# EAGLE schematic M840K (EAGLE 6.6.0)

## Sheet 1 of 2
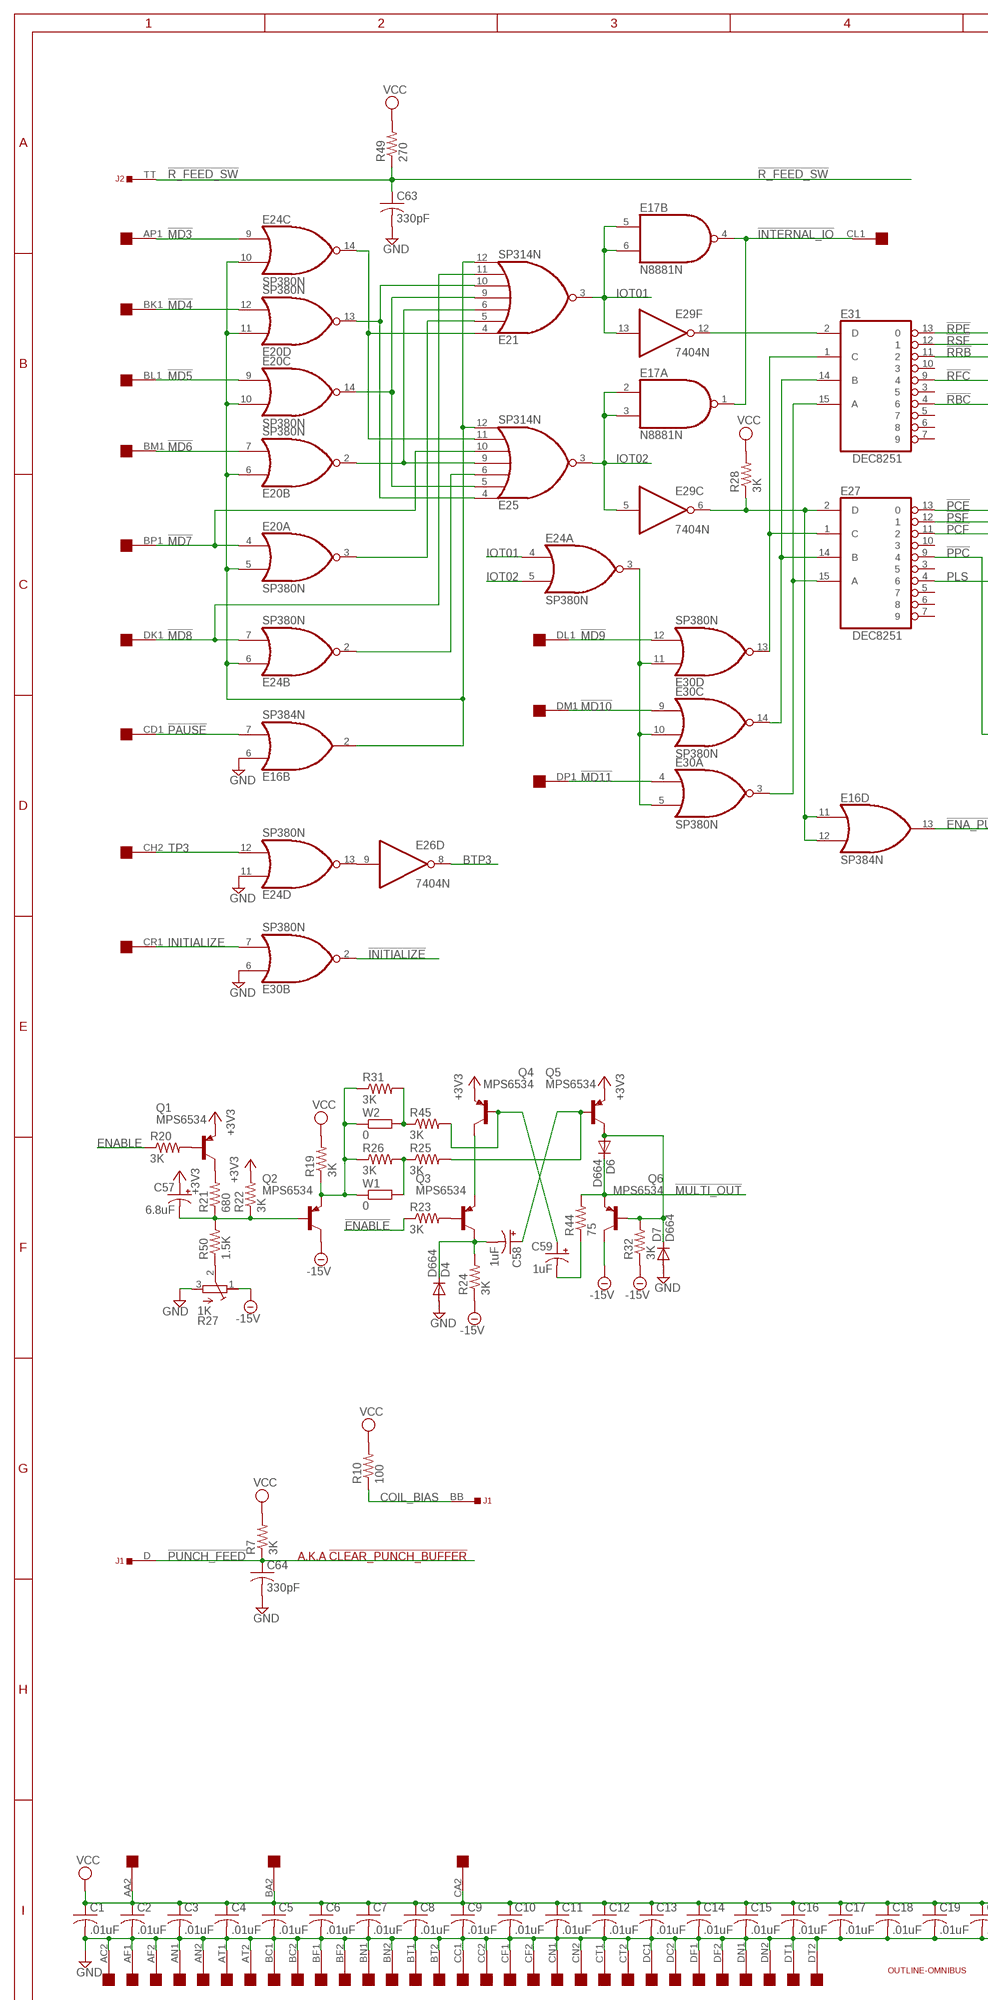
[diagram p0: schematic, sheet 1, part 1 of 2]
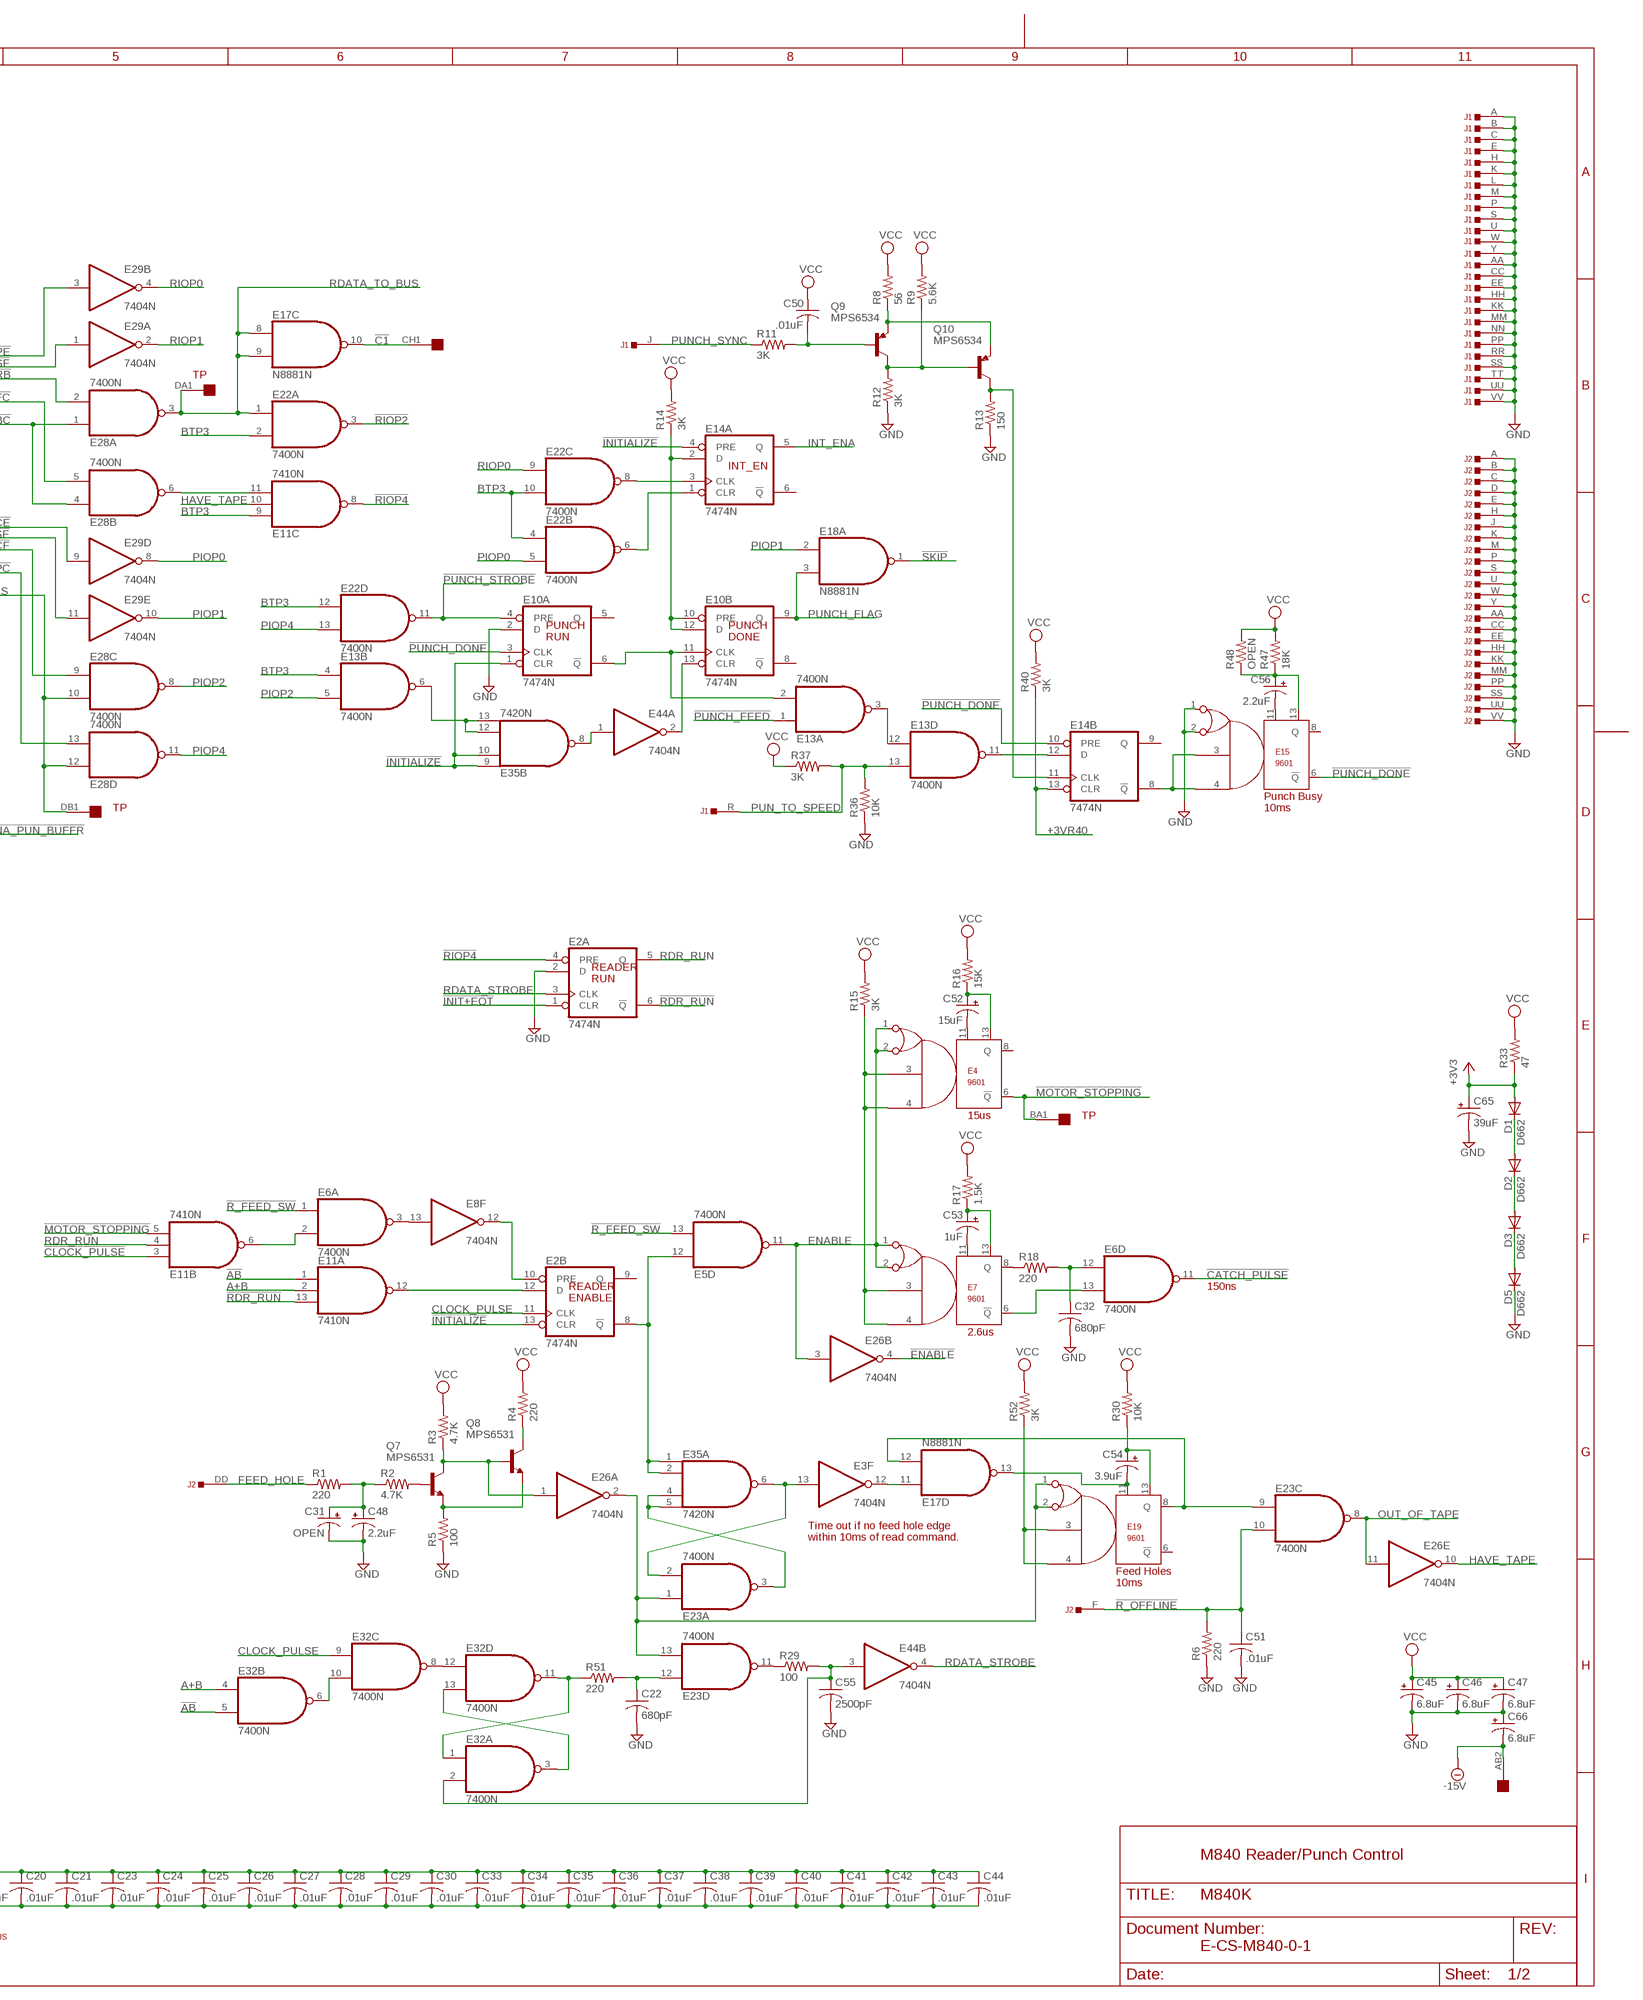
[diagram p1: schematic, sheet 1, part 2 of 2]

### Parts
C1  .01uF  C-US  [C063-025X075]
C2  .01uF  C-US  [C063-025X075]
C3  .01uF  C-US  [C063-025X075]
C4  .01uF  C-US  [C063-025X075]
C5  .01uF  C-US  [C063-025X075]
C6  .01uF  C-US  [C063-025X075]
C7  .01uF  C-US  [C063-025X075]
C8  .01uF  C-US  [C063-025X075]
C9  .01uF  C-US  [C063-025X075]
C10  .01uF  C-US  [C063-025X075]
C11  .01uF  C-US  [C063-025X075]
C12  .01uF  C-US  [C063-025X075]
C13  .01uF  C-US  [C063-025X075]
C14  .01uF  C-US  [C063-025X075]
C15  .01uF  C-US  [C063-025X075]
C16  .01uF  C-US  [C063-025X075]
C17  .01uF  C-US  [C063-025X075]
C18  .01uF  C-US  [C063-025X075]
C19  .01uF  C-US  [C063-025X075]
C20  .01uF  C-US  [C063-025X075]
C21  .01uF  C-US  [C063-025X075]
C22  680pF  C-US  [C063-025X075]
C23  .01uF  C-US  [C063-025X075]
C24  .01uF  C-US  [C063-025X075]
C25  .01uF  C-US  [C063-025X075]
C26  .01uF  C-US  [C063-025X075]
C27  .01uF  C-US  [C063-025X075]
C28  .01uF  C-US  [C063-025X075]
C29  .01uF  C-US  [C063-025X075]
C30  .01uF  C-US  [C063-025X075]
C31  OPEN  CPOL-USE15-5AXIAL  [E15-5]
C32  680pF  C-US  [C063-025X075]
C33  .01uF  C-US  [C063-025X075]
C34  .01uF  C-US  [C063-025X075]
C35  .01uF  C-US  [C063-025X075]
C36  .01uF  C-US  [C063-025X075]
C37  .01uF  C-US  [C063-025X075]
C38  .01uF  C-US  [C063-025X075]
C39  .01uF  C-US  [C063-025X075]
C40  .01uF  C-US  [C063-025X075]
C41  .01uF  C-US  [C063-025X075]
C42  .01uF  C-US  [C063-025X075]
C43  .01uF  C-US  [C063-025X075]
C44  .01uF  C-US  [C063-025X075]
C45  6.8uF  CPOL-USE20-8AXIAL  [E12-8]
C46  6.8uF  CPOL-USE20-8AXIAL  [E12-8]
C47  6.8uF  CPOL-USE20-8AXIAL  [E12-8]
C48  2.2uF  CPOL-USE15-5AXIAL  [E15-5]
C50  .01uF  C-US8  [C203-054-229]
C51  .01uF  C-US8  [C203-054-229]
C52  15uF  CPOL-USE20-8AXIAL  [E12-8]
C53  1uF  CPOL-USE15-5AXIAL  [E15-5]
C54  3.9uF  CPOL-USE15-5AXIAL  [E15-5]
C55  2500pF  C-US  [C063-025X075]
C56  2.2uF  CPOL-USE15-5AXIAL  [E15-5]
C57  6.8uF  CPOL-USE20-8AXIAL  [E12-8]
C58  1uF  CPOL-USE15-5AXIAL  [E15-5]
C59  1uF  CPOL-USE15-5AXIAL  [E15-5]
C63  330pF  C-US  [C063-025X075]
C64  330pF  C-US  [C063-025X075]
C65  39uF  CPOL-USE20-8AXIAL  [E12-8]
C66  6.8uF  CPOL-USE20-8AXIAL  [E12-8]
D1  D662  DIODE-DO35-10  [DO35-10]
D2  D662  DIODE-DO35-10  [DO35-10]
D3  D662  DIODE-DO35-10  [DO35-10]
D4  D664  DIODE-DO35-10  [DO35-10]
D5  D662  DIODE-DO35-10  [DO35-10]
D6  D664  DIODE-DO35-10  [DO35-10]
D7  D664  DIODE-DO35-10  [DO35-10]
E2  7474N  74S74N  [DIL14]
E3  7404N  [DIL14]
E4  9601  [DIL14]
E5  7400N  [DIL14]
E6  7400N  [DIL14]
E7  9601  [DIL14]
E8  7404N  [DIL14]
E10  7474N  74S74N  [DIL14]
E11  7410N  [DIL14]
E13  7400N  [DIL14]
E14  7474N  74S74N  [DIL14]
E15  9601  [DIL14]
E16  SP384N  [DIL14]
E17  N8881N  [DIL14]
E18  N8881N  [DIL14]
E19  9601  [DIL14]
E20  SP380N  [DIL14]
E21  SP314N  [DIL14]
E22  7400N  [DIL14]
E23  7400N  [DIL14]
E24  SP380N  [DIL14]
E25  SP314N  [DIL14]
E26  7404N  [DIL14]
E27  DEC8251  [DIL16]
E28  7400N  [DIL14]
E29  7404N  [DIL14]
E30  SP380N  [DIL14]
E31  DEC8251  [DIL16]
E32  7400N  [DIL14]
E35  7420N  [DIL14]
E44  7404N  [DIL14]
J1  DEC40PINSH  [DEC40PINH]
J2  DEC40PINSH  [DEC40PINH]
OMNIBUS  QUAD  [EDGE-CON8]
Q1  MPS6534  -PNP-TO5  [TO5]
Q2  MPS6534  -PNP-TO5  [TO5]
Q3  MPS6534  -PNP-TO5  [TO5]
Q4  MPS6534  -PNP-TO5  [TO5]
Q5  MPS6534  -PNP-TO5  [TO5]
Q6  MPS6534  -PNP-TO5  [TO5]
Q7  MPS6531  -NPN-TO5  [TO5]
Q8  MPS6531  -NPN-TO5  [TO5]
Q9  MPS6534  -PNP-TO5  [TO5]
Q10  MPS6534  -PNP-TO5  [TO5]
R1  220  R-US_0207/10  [0207/10]
R2  4.7K  R-US_0207/10  [0207/10]
R3  4.7K  R-US_0207/10  [0207/10]
R4  220  R-US_0207/10  [0207/10]
R5  100  R-US_0207/10  [0207/10]
R6  220  R-US_0207/10  [0207/10]
R7  3K  R-US_0207/10  [0207/10]
R8  56  R-US_0207/10  [0207/10]
R9  5.6K  R-US_0207/10  [0207/10]
R10  100  R-US_0207/10  [0207/10]
R11  3K  R-US_0207/10  [0207/10]
R12  3K  R-US_0207/10  [0207/10]
R13  150  R-US_0207/10  [0207/10]
R14  3K  R-US_0207/10  [0207/10]
R15  3K  R-US_0207/10  [0207/10]
R16  15K  R-US_0207/10  [0207/10]
R17  1.5K  R-US_0207/10  [0207/10]
R18  220  R-US_0207/10  [0207/10]
R19  3K  R-US_0207/10  [0207/10]
R20  3K  R-US_0207/10  [0207/10]
R21  680  R-US_0207/10  [0207/10]
R22  3K  R-US_0207/10  [0207/10]
R23  3K  R-US_0207/10  [0207/10]
R24  3K  R-US_0207/10  [0207/10]
R25  3K  R-US_0207/10  [0207/10]
R26  3K  R-US_0207/10  [0207/10]
R27  1K  275P  [3006Y]
R28  3K  R-US_0207/10  [0207/10]
R29  100  R-US_0207/10  [0207/10]
R30  10K  R-US_0207/10  [0207/10]
R31  3K  R-US_0207/10  [0207/10]
R32  3K  R-US_0207/10  [0207/10]
R33  47  R-US_0207/10  [0207/10]
R36  10K  R-US_0207/10  [0207/10]
R37  3K  R-US_0207/10  [0207/10]
R40  3K  R-US_0207/10  [0207/10]
R44  75  R-US_0207/10  [0207/10]
R45  3K  R-US_0207/10  [0207/10]
R47  18K  R-US_0207/10  [0207/10]
R48  OPEN  R-US_0207/10  [0207/10]
R49  270  R-US_0207/10  [0207/10]
R50  1.5K  R-US_0207/10  [0207/10]
R51  220  R-US_0207/10  [0207/10]
R52  3K  R-US_0207/10  [0207/10]
U$1  OUTLINE-OMNIBUS  [OMNIBUS]
W1  0  R-EU_0207/10  [0207/10]
W2  0  R-EU_0207/10  [0207/10]

### Nets
!AB: E11.1(A:I0) E32.5(B:I1) ; also sheet 2
!C1: E17.10(C:O) OMNIBUS.CH1
!CATCH_PULSE: E6.11(D:O) ; also sheet 2
!CLOCK_PULSE: E11.3(B:I0) ; also sheet 2
!ENA_PUN_BUFFR: E16.13(D:O) ; also sheet 2
!ENABLE: E26.4(B:O) R23.1
!INIT+EOT: E2.1(A:CLR) ; also sheet 2
!INITIALIZE: E2.13(B:CLR) E10.1(A:CLR) E14.4(A:PRE) E30.2(B:O) E35.9(B:I0) E35.10(B:I1) ; also sheet 2
!INTERNAL_IO: E17.1(A:O) E17.4(B:O) OMNIBUS.CL1
!IOT: E24.3(A:O) E30.5(A:I1) E30.10(C:I1) E30.11(D:I0)
!MD3: E24.9(C:I0) OMNIBUS.AP1
!MD4: E20.12(D:I1) OMNIBUS.BK1
!MD5: E20.9(C:I0) OMNIBUS.BL1
!MD6: E20.7(B:I1) OMNIBUS.BM1
!MD7: E20.4(A:I0) E25.10(I4) OMNIBUS.BP1
!MD8: E21.11(I5) E24.7(B:I1) OMNIBUS.DK1
!MD9: E30.12(D:I1) OMNIBUS.DL1
!MD10: E30.9(C:I0) OMNIBUS.DM1
!MD11: E30.4(A:I0) OMNIBUS.DP1
!MOTOR_STOPPING: E4.6(!Q) E11.5(B:I2) OMNIBUS.BA1 ; also sheet 2
!MULTI_OUT: D6.C Q6.1(E) R44.2 ; also sheet 2
!PAUSE: E16.7(B:I1) OMNIBUS.CD1
!PCE: E27.13 E29.9(D:I)
!PCF: E27.11 E28.9(C:I0)
!PPC: E27.9 E28.13(D:I1)
!PSF: E27.12 E29.11(E:I)
!PUNCH_DONE: E10.3(A:CLK) E14.10(B:PRE) E15.6(!Q) ; also sheet 2
!PUNCH_FEED: C64.1 E13.1(A:I0) J1.D R7.1 ; also sheet 2
!PUNCH_STROBE: E10.4(A:PRE) E22.11(D:O) ; also sheet 2
!R_FEED_SW: C63.1 E5.13(D:I1) E6.1(A:I0) J2.TT R49.1
!R_OFFLINE: C51.1 E23.10(C:I1) J2.F R6.2
!RBC: E28.1(A:I0) E28.4(B:I0) E31.4
!RDR_RUN: E2.6(A:!Q) E11.13(A:I2)
!RFC: E28.5(B:I1) E31.9
!RIOP2: E22.3(A:O) ; also sheet 2
!RIOP4: E2.4(A:PRE) E11.8(C:O) ; also sheet 2
!RPE: E29.3(B:I) E31.13
!RRB: E28.2(A:I1) E31.11
!RSF: E29.1(A:I) E31.12
!SKIP: E18.1(A:O) ; also sheet 2
+3V3: C57.+ C65.+ D1.A Q1.1(E) Q4.1(E) Q5.1(E) R22.2 R33.1
+3VR40: E14.13(B:CLR) R40.1 ; also sheet 2
-15V [supply]: C66.- OMNIBUS.AB2 Q2.3(C) Q6.3(C) R24.1 R27.1(A) R32.1
A+B: E11.2(A:I1) E32.4(B:I0) ; also sheet 2
BTP3: E11.9(C:I0) E13.4(B:I0) E22.2(A:I1) E22.4(B:I0) E22.10(C:I1) E22.12(D:I0) E26.8(D:O)
CLOCK_PULSE: E2.11(B:CLK) E32.9(C:I0) ; also sheet 2
COIL_BIAS: J1.BB R10.1
ENABLE: E4.1 E4.2 E5.11(D:O) E7.1 E7.2 E26.3(B:I) R20.1 ; also sheet 2
FEED_HOLE: J2.DD R1.1
GND [supply]: C1.2 C2.2 C3.2 C4.2 C5.2 C6.2 C7.2 C8.2 C9.2 C10.2 C11.2 C12.2 C13.2 C14.2 C15.2 C16.2 C17.2 C18.2 C19.2 C20.2 C21.2 C22.2 C23.2 C24.2 C25.2 C26.2 C27.2 C28.2 C29.2 C30.2 C31.- C32.2 C33.2 C34.2 C35.2 C36.2 C37.2 C38.2 C39.2 C40.2 C41.2 C42.2 C43.2 C44.2 C45.- C46.- C47.- C48.- C51.2 C55.2 C63.2 C64.2 C65.- C66.+ D4.A D5.C D7.A E2.2(A:D) E10.2(A:D) E15.1 E15.2 E16.6(B:I0) E24.11(D:I0) E30.6(B:I0) J1.A J1.AA J1.B J1.C J1.CC J1.E J1.EE J1.H J1.HH J1.K J1.KK J1.L J1.M J1.MM J1.NN J1.P J1.PP J1.RR J1.S J1.SS J1.TT J1.U J1.UU J1.VV J1.W J1.Y J2.A J2.AA J2.B J2.C J2.CC J2.D J2.E J2.EE J2.H J2.HH J2.J J2.K J2.KK J2.M J2.MM J2.P J2.PP J2.S J2.SS J2.U J2.UU J2.VV J2.W J2.Y OMNIBUS.AC2 OMNIBUS.AF1 OMNIBUS.AF2 OMNIBUS.AN1 OMNIBUS.AN2 OMNIBUS.AT1 OMNIBUS.AT2 OMNIBUS.BC1 OMNIBUS.BC2 OMNIBUS.BF1 OMNIBUS.BF2 OMNIBUS.BN1 OMNIBUS.BN2 OMNIBUS.BT1 OMNIBUS.BT2 OMNIBUS.CC1 OMNIBUS.CC2 OMNIBUS.CF1 OMNIBUS.CF2 OMNIBUS.CN1 OMNIBUS.CN2 OMNIBUS.CT1 OMNIBUS.CT2 OMNIBUS.DC1 OMNIBUS.DC2 OMNIBUS.DF1 OMNIBUS.DF2 OMNIBUS.DN1 OMNIBUS.DN2 OMNIBUS.DT1 OMNIBUS.DT2 R5.1 R6.1 R12.1 R13.1 R27.3(E) R36.1 ; also sheet 2
HAVE_TAPE: E11.10(C:I1) E26.10(E:O)
INITIALIZE: E30.7(B:I1) OMNIBUS.CR1
INT_ENA: E14.5(A:Q) ; also sheet 2
IOT01: E17.5(B:I0) E17.6(B:I1) E21.3(O) E24.4(A:I0) E29.13(F:I)
IOT02: E17.2(A:I0) E17.3(A:I1) E24.5(A:I1) E25.3(O) E29.5(C:I)
N$1: E24.13(D:O) E26.9(D:I)
N$2: C31.+ C48.+ R1.2 R2.1
N$3: Q7.1(E) Q8.1(E) R5.2
N$4: E27.1(C) E30.13(D:O) E31.1(C)
N$5: E20.2(B:O) E21.6(I2) E25.9(I3)
N$6: E16.2(B:O) E20.5(A:I1) E20.6(B:I0) E20.10(C:I1) E20.11(D:I0) E21.12(I6) E24.6(B:I0) E24.10(C:I1) E25.12(I6)
N$7: E26.1(A:I) Q7.3(C) Q8.2(B) R3.1
N$8: Q7.2(B) R2.2
N$9: Q8.3(C) R4.1
N$10: E21.4(I0) E24.14(C:O) E25.11(I5)
N$11: Q9.1(E) Q10.1(E) R8.1
N$12: E20.13(D:O) E21.10(I4) E25.4(I0)
N$13: C50.2 Q9.2(B) R11.2
N$14: E20.14(C:O) E21.9(I3) E25.5(I1)
N$15: E24.2(B:O) E25.6(I2)
N$16: E29.12(F:O) E31.2(D)
N$17: E20.3(A:O) E21.5(I1)
N$18: E16.11(D:I0) E16.12(D:I1) E27.2(D) E29.6(C:O) R28.1
N$19: E27.14(B) E30.14(C:O) E31.14(B)
N$20: E27.15(A) E30.3(A:O) E31.15(A)
N$21: Q9.3(C) Q10.2(B) R9.1 R12.2
N$22: E14.11(B:CLK) Q10.3(C) R13.2
N$25: E11.11(C:I2) E28.6(B:O)
N$38: D3.C D5.A
N$44: D2.C D3.A
N$45: R25.1 R26.2 W1.2
N$68: D1.C D2.A
N$77: Q3.2(B) R23.2
N$79: E14.3(A:CLK) E22.8(C:O)
N$80: E14.1(A:CLR) E22.6(B:O)
N$81: E10.10(B:PRE) E10.12(B:D) E14.2(A:D) R14.1
N$82: E4.3 E4.4 E7.3 E7.4 R15.1
N$83: C52.- E4.11
N$84: C52.+ E4.13 R16.1
N$85: C53.- E7.11
N$86: C53.+ E7.13 R17.1
N$87: E7.8(Q) R18.1
N$88: C32.1 E6.12(D:I0) R18.2
N$89: E6.13(D:I1) E7.6(!Q)
N$90: E2.8(B:!Q) E5.12(D:I0) E35.1(A:I0) E35.2(A:I1)
N$91: D6.A D7.C Q5.3(C) Q6.2(B) R32.2
N$92: Q1.2(B) R20.2
N$93: C54.- E17.13(D:O) E19.11
N$94: Q1.3(C) R21.2
N$95: C57.- Q2.2(B) R21.1 R22.1 R50.2
N$96: R27.2(S) R50.1
N$97: Q2.1(E) R19.1 R26.1 R31.1 W1.1 W2.1
N$98: R31.2 R45.1 W2.2
N$99: Q3.1(E) Q4.3(C)
N$100: C54.+ E19.13 R30.1
N$101: E19.3 E19.4 R52.1
N$102: C58.+ Q5.2(B) R25.2
N$103: C59.+ Q4.2(B) R45.2
N$104: C58.- D4.C Q3.3(C) R24.2
N$105: C59.- R44.1
N$106: E19.1 E19.2 E23.1(A:I0) E23.13(D:I1) E26.2(A:O)
N$107: E17.12(D:I1) E19.8(Q) E23.9(C:I0)
N$108: C22.1 E23.12(D:I0) R51.2
N$109: E3.12(F:O) E17.11(D:I0)
N$110: E3.13(F:I) E23.2(A:I1) E35.6(A:O)
N$111: E23.3(A:O) E35.4(A:I2) E35.5(A:I3)
N$112: E32.1(A:I0) E32.11(D:O) R51.1
N$113: E2.10(B:PRE) E8.12(F:O)
N$114: E32.3(A:O) E32.13(D:I1)
N$115: E23.11(D:O) R29.1
N$116: C55.1 E32.2(A:I1) E44.3(B:I) R29.2
N$117: E32.8(C:O) E32.12(D:I0)
N$118: E32.6(B:O) E32.10(C:I1)
N$119: E6.3(A:O) E8.13(F:I)
N$120: E2.12(B:D) E11.12(A:O)
N$122: E13.6(B:O) E35.12(B:I2) E35.13(B:I3)
N$123: E35.8(B:O) E44.1(A:I)
N$124: E10.13(B:CLR) E44.2(A:O)
N$125: E6.2(A:I1) E11.6(B:O)
N$126: E10.6(A:!Q) E10.11(B:CLK) E13.2(A:I1)
N$127: E13.3(A:O) E13.12(D:I0)
N$128: E13.11(D:O) E14.12(B:D)
N$129: E14.8(B:!Q) E15.3 E15.4
N$131: C56.- E15.11
N$132: C56.+ E15.13 R47.1 R48.1
OUT_OF_TAPE: E23.8(C:O) E26.11(E:I) ; also sheet 2
PIOP0: E22.5(B:I1) E29.8(D:O)
PIOP1: E18.2(A:I0) E29.10(E:O)
PIOP2: E13.5(B:I1) E28.8(C:O)
PIOP4: E22.13(D:I1) E28.11(D:O)
PLS: E27.4 E28.10(C:I1) E28.12(D:I0) OMNIBUS.DB1
PUN_TO_SPEED: E13.13(D:I1) J1.R R36.2 R37.2
PUNCH_FLAG: E10.9(B:Q) E18.3(A:I1) ; also sheet 2
PUNCH_SYNC: J1.J R11.1
RDATA_STROBE: E2.3(A:CLK) E44.4(B:O) ; also sheet 2
RDATA_TO_BUS: E17.8(C:I0) E17.9(C:I1) E22.1(A:I0) E28.3(A:O) OMNIBUS.DA1 ; also sheet 2
RDR_RUN: E2.5(A:Q) E11.4(B:I1) ; also sheet 2
RIOP0: E22.9(C:I0) E29.4(B:O)
RIOP1: E29.2(A:O) ; also sheet 2
TP3: E24.12(D:I1) OMNIBUS.CH2
VCC [supply]: C1.1 C2.1 C3.1 C4.1 C5.1 C6.1 C7.1 C8.1 C9.1 C10.1 C11.1 C12.1 C13.1 C14.1 C15.1 C16.1 C17.1 C18.1 C19.1 C20.1 C21.1 C23.1 C24.1 C25.1 C26.1 C27.1 C28.1 C29.1 C30.1 C33.1 C34.1 C35.1 C36.1 C37.1 C38.1 C39.1 C40.1 C41.1 C42.1 C43.1 C44.1 C45.+ C46.+ C47.+ C50.1 OMNIBUS.AA2 OMNIBUS.BA2 OMNIBUS.CA2 R3.2 R4.2 R7.2 R8.2 R9.2 R10.2 R14.2 R15.2 R16.2 R17.2 R19.2 R28.2 R30.2 R33.2 R37.1 R40.2 R47.2 R48.2 R49.2 R52.2 ; also sheet 2
Unconnected: E2.9(B:Q) E4.8(Q) E10.5(A:Q) E10.8(B:!Q) E14.6(A:!Q) E14.9(B:Q) E15.8(Q) E16.3(A:O) E16.4(A:I0) E16.5(A:I1) E16.9(C:I0) E16.10(C:I1) E16.14(C:O) E19.6(!Q) E21.2(NC) E21.7(NC) E21.13(NC) E21.14(NC) E23.4(B:I0) E23.5(B:I1) E23.6(B:O) E25.2(NC) E25.7(NC) E25.13(NC) E25.14(NC) E27.3 E27.5 E27.6 E27.7 E27.10 E31.3 E31.5 E31.6 E31.7 E31.10 E35.3(3:NC) E35.11(11:NC) OMNIBUS.AA1 OMNIBUS.AB1 OMNIBUS.AC1 OMNIBUS.AD1 OMNIBUS.AD2 OMNIBUS.AE1 OMNIBUS.AE2 OMNIBUS.AH1 OMNIBUS.AH2 OMNIBUS.AJ1 OMNIBUS.AJ2 OMNIBUS.AK1 OMNIBUS.AK2 OMNIBUS.AL1 OMNIBUS.AL2 OMNIBUS.AM1 OMNIBUS.AM2 OMNIBUS.AP2 OMNIBUS.AR1 OMNIBUS.AR2 OMNIBUS.AS1 OMNIBUS.AS2 OMNIBUS.AU1 OMNIBUS.AU2 OMNIBUS.AV1 OMNIBUS.AV2 OMNIBUS.BB1 OMNIBUS.BB2 OMNIBUS.BD1 OMNIBUS.BD2 OMNIBUS.BE1 OMNIBUS.BE2 OMNIBUS.BH1 OMNIBUS.BH2 OMNIBUS.BJ1 OMNIBUS.BJ2 OMNIBUS.BK2 OMNIBUS.BL2 OMNIBUS.BM2 OMNIBUS.BP2 OMNIBUS.BR2 OMNIBUS.BS2 OMNIBUS.BU2 OMNIBUS.BV2 OMNIBUS.CA1 OMNIBUS.CB1 OMNIBUS.CB2 OMNIBUS.CD2 OMNIBUS.CE1 OMNIBUS.CE2 OMNIBUS.CJ1 OMNIBUS.CJ2 OMNIBUS.CK1 OMNIBUS.CK2 OMNIBUS.CL2 OMNIBUS.CM1 OMNIBUS.CM2 OMNIBUS.CP2 OMNIBUS.CR2 OMNIBUS.CS2 OMNIBUS.CU1 OMNIBUS.CU2 OMNIBUS.CV1 OMNIBUS.CV2 OMNIBUS.DA2 OMNIBUS.DB2 OMNIBUS.DD1 OMNIBUS.DD2 OMNIBUS.DE1 OMNIBUS.DE2 OMNIBUS.DH1 OMNIBUS.DH2 OMNIBUS.DJ1 OMNIBUS.DJ2 OMNIBUS.DK2 OMNIBUS.DL2 OMNIBUS.DM2 OMNIBUS.DP2 OMNIBUS.DR2 OMNIBUS.DS2 OMNIBUS.DU2 OMNIBUS.DV2

### Notes on the sheet
- TP
- INT_EN
- PUNCH | PUNCH
- RUN | DONE
- Punch Busy
- TP | 10ms
- READER
- RUN
- 15us | TP
- READER | 150ns
- ENABLE
- 2.6us
- Time out if no feed hole edge
- A.K.A !CLEAR_PUNCH_BUFFER | within 10ms of read command.
- Feed Holes
- 10ms
- M840 Reader/Punch Control
- E-CS-M840-0-1

## Sheet 2 of 2
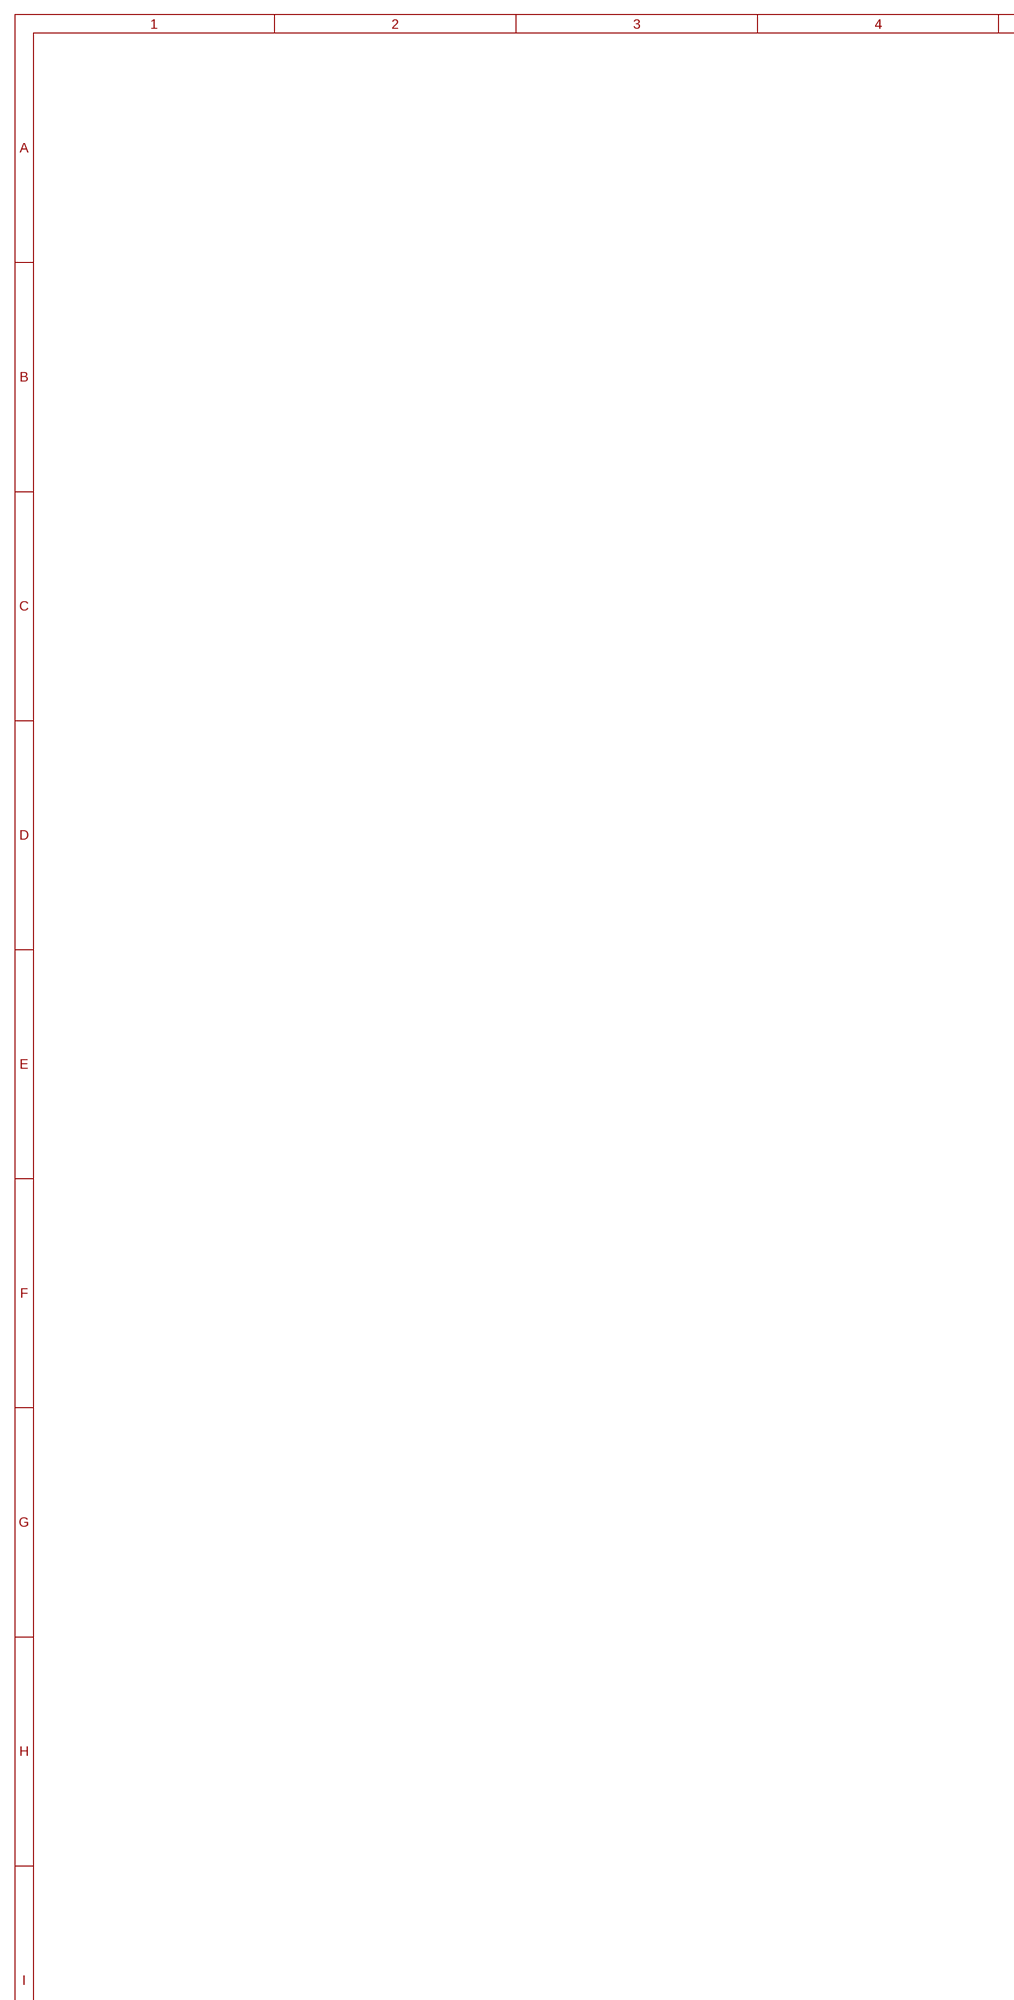
[diagram p2: schematic, sheet 2, part 1 of 2]
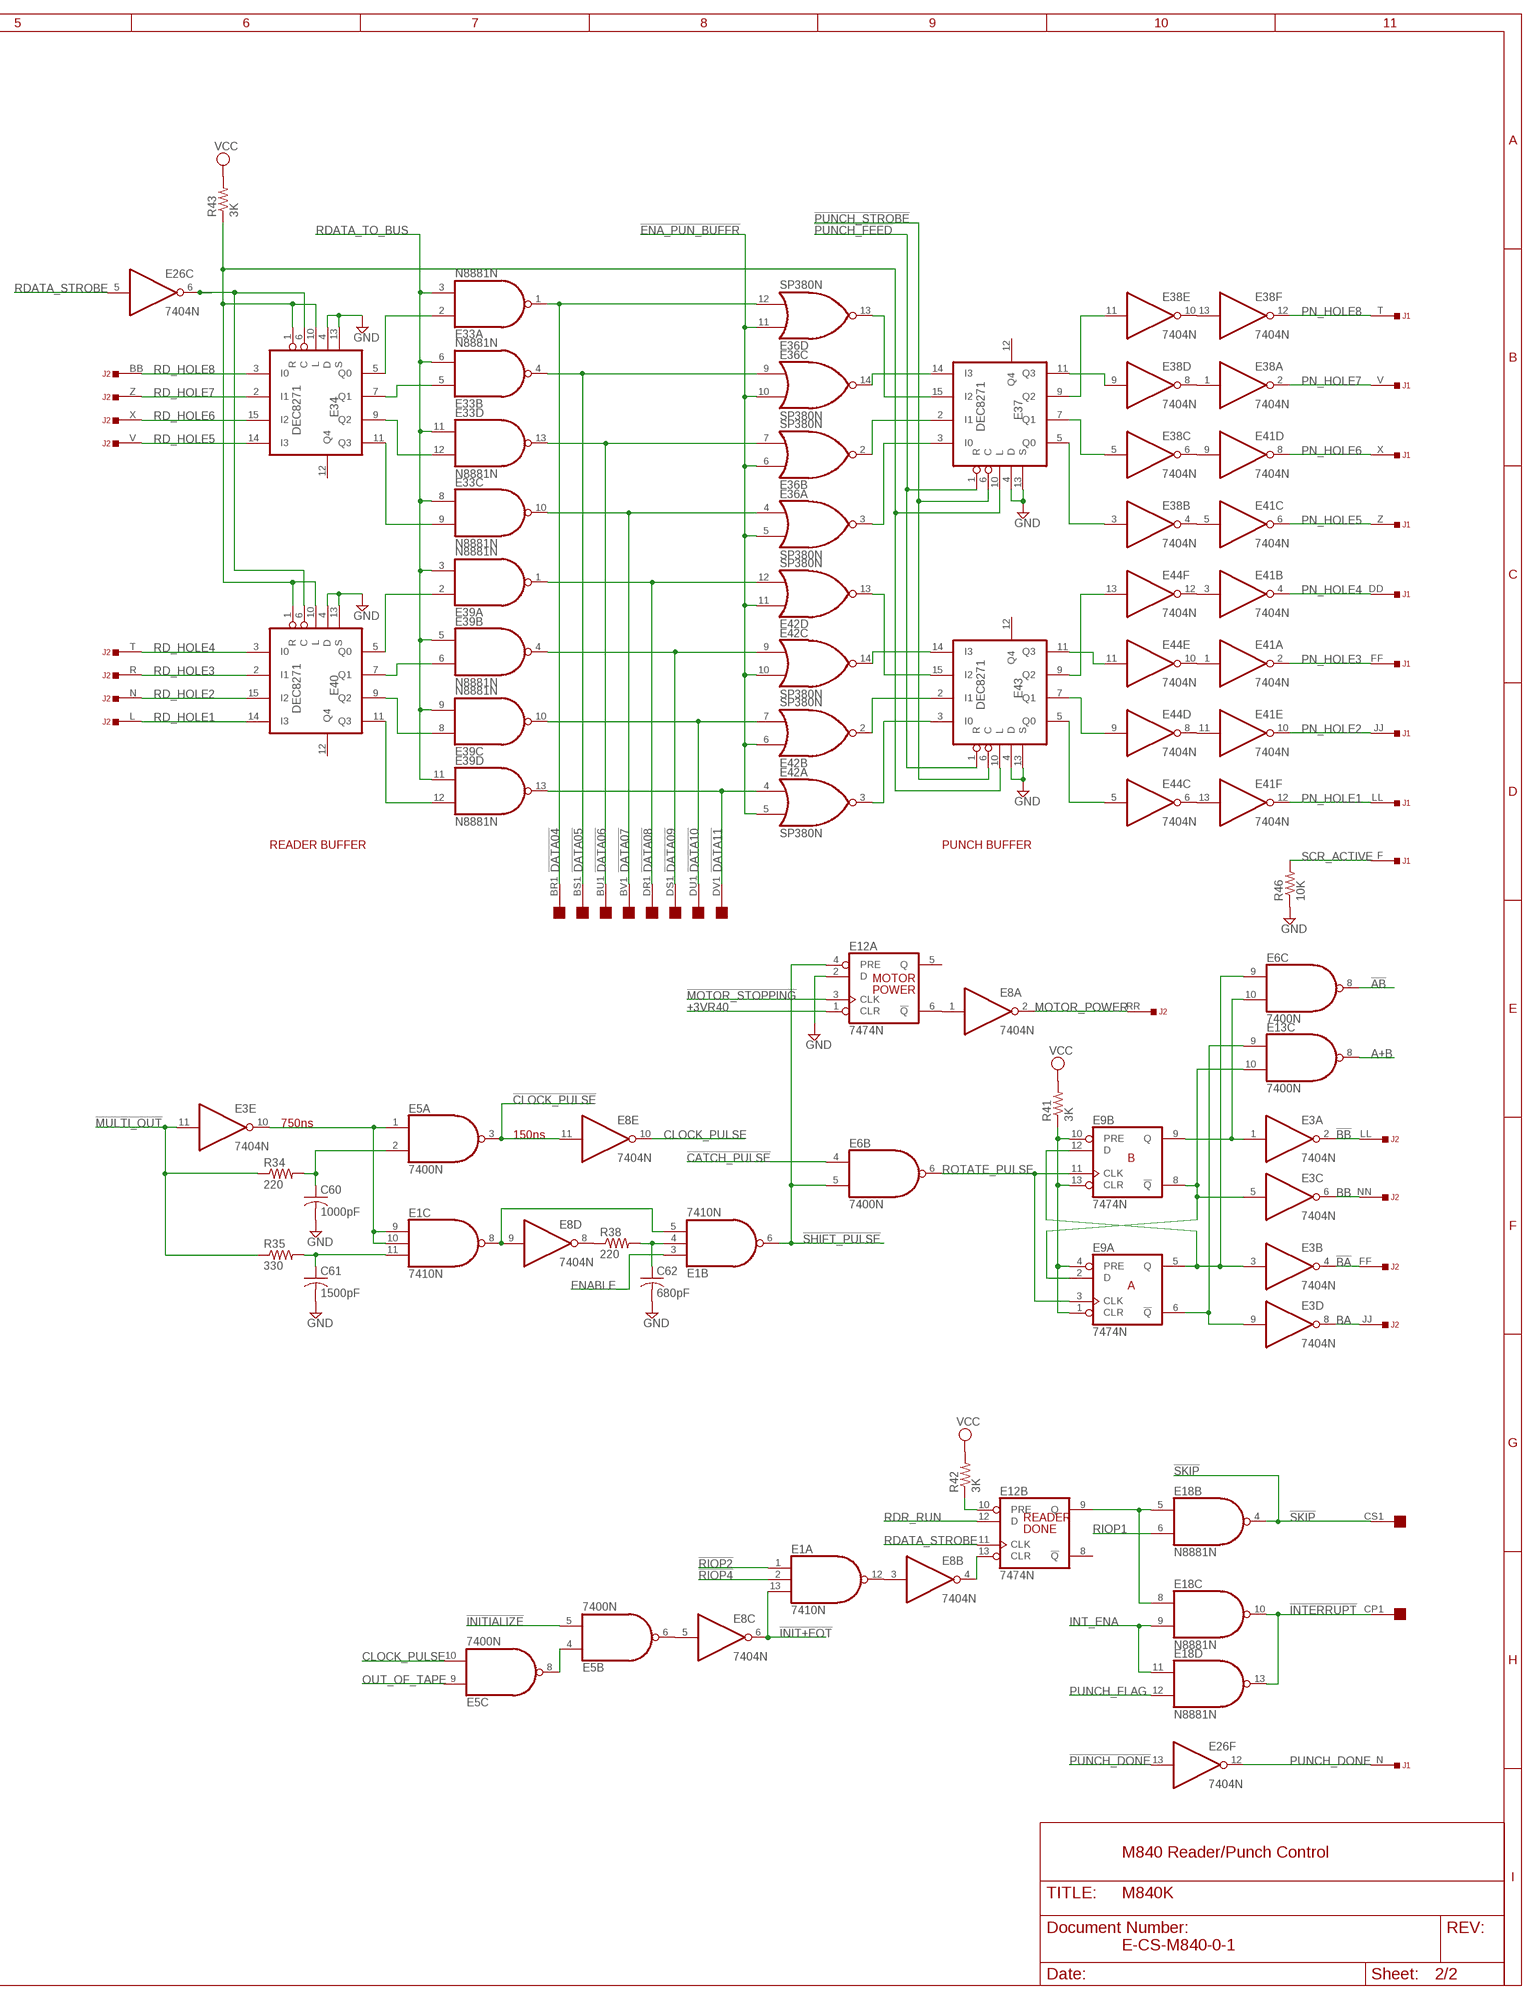
[diagram p3: schematic, sheet 2, part 2 of 2]

### Parts
C60  1000pF  C-US  [C063-025X075]
C61  1500pF  C-US  [C063-025X075]
C62  680pF  C-US  [C063-025X075]
E1  7410N  [DIL14]
E9  7474N  74S74N  [DIL14]
E12  7474N  74S74N  [DIL14]
E33  N8881N  [DIL14]
E34  DEC8271  [DIL16]
E36  SP380N  [DIL14]
E37  DEC8271  [DIL16]
E38  7404N  [DIL14]
E39  N8881N  [DIL14]
E40  DEC8271  [DIL16]
E41  7404N  [DIL14]
E42  SP380N  [DIL14]
E43  DEC8271  [DIL16]
R34  220  R-US_0207/10  [0207/10]
R35  330  R-US_0207/10  [0207/10]
R38  220  R-US_0207/10  [0207/10]
R41  3K  R-US_0207/10  [0207/10]
R42  3K  R-US_0207/10  [0207/10]
R43  3K  R-US_0207/10  [0207/10]
R46  10K  R-US_0207/10  [0207/10]

### Nets
!AB: E6.8(C:O) ; also sheet 1
!BA: E3.4(B:O) J2.FF
!BB: E3.2(A:O) J2.LL
!CATCH_PULSE: E6.4(B:I0) ; also sheet 1
!CLOCK_PULSE: E5.3(A:O) E8.11(E:I) ; also sheet 1
!DATA04: E33.1(A:O) E36.12(D:I1) OMNIBUS.BR1
!DATA05: E33.4(B:O) E36.9(C:I0) OMNIBUS.BS1
!DATA06: E33.13(D:O) E36.7(B:I1) OMNIBUS.BU1
!DATA07: E33.10(C:O) E36.4(A:I0) OMNIBUS.BV1
!DATA08: E39.1(A:O) E42.12(D:I1) OMNIBUS.DR1
!DATA09: E39.4(B:O) E42.9(C:I0) OMNIBUS.DS1
!DATA10: E39.10(C:O) E42.7(B:I1) OMNIBUS.DU1
!DATA11: E39.13(D:O) E42.4(A:I0) OMNIBUS.DV1
!ENA_PUN_BUFFR: E36.5(A:I1) E36.6(B:I0) E36.10(C:I1) E36.11(D:I0) E42.5(A:I1) E42.6(B:I0) E42.10(C:I1) E42.11(D:I0) ; also sheet 1
!INIT+EOT: E1.13(A:I2) E8.6(C:O) ; also sheet 1
!INITIALIZE: E5.5(B:I1) ; also sheet 1
!INTERRUPT: E18.10(C:O) E18.13(D:O) OMNIBUS.CP1
!MOTOR_STOPPING: E12.3(A:CLK) ; also sheet 1
!MULTI_OUT: E3.11(E:I) R34.1 R35.1 ; also sheet 1
!PUNCH_DONE: E26.13(F:I) ; also sheet 1
!PUNCH_FEED: E37.1(R) E43.1(R) ; also sheet 1
!PUNCH_STROBE: E37.6(C) E43.6(C) ; also sheet 1
!RIOP2: E1.1(A:I0) ; also sheet 1
!RIOP4: E1.2(A:I1) ; also sheet 1
!SHIFT_PULSE: E1.6(B:O) E6.5(B:I1) E12.4(A:PRE)
!SKIP: E18.4(B:O) OMNIBUS.CS1 ; also sheet 1
+3VR40: E12.1(A:CLR) ; also sheet 1
A+B: E13.8(C:O) ; also sheet 1
BA: E3.8(D:O) J2.JJ
BB: E3.6(C:O) J2.NN
CLOCK_PULSE: E5.10(C:I1) E8.10(E:O) ; also sheet 1
ENABLE: E1.3(B:I0) ; also sheet 1
GND [supply]: C60.2 C61.2 C62.2 E12.2(A:D) E34.4(D) E34.13(S) E37.4(D) E37.13(S) E40.4(D) E40.13(S) E43.4(D) E43.13(S) R46.1 ; also sheet 1
INT_ENA: E18.9(C:I1) E18.11(D:I0) ; also sheet 1
MOTOR_POWER: E8.2(A:O) J2.RR
N$23: E12.9(B:Q) E18.5(B:I0) E18.8(C:I0)
N$24: E33.2(A:I0) E34.5(Q0)
N$26: E33.5(B:I0) E34.7(Q1)
N$27: E33.12(D:I1) E34.9(Q2)
N$28: E33.9(C:I1) E34.11(Q3)
N$29: E39.2(A:I0) E40.5(Q0)
N$30: E39.6(B:I1) E40.7(Q1)
N$31: E39.8(C:I0) E40.9(Q2)
N$32: E39.12(D:I1) E40.11(Q3)
N$33: E12.10(B:PRE) R42.1
N$34: E34.1(R) E34.10(L) E37.10(L) E40.1(R) E40.10(L) E43.10(L) R43.1
N$35: E5.4(B:I0) E5.8(C:O)
N$36: E42.3(A:O) E43.3(I0)
N$37: E26.6(C:O) E34.6(C) E40.6(C)
N$39: E42.2(B:O) E43.2(I1)
N$40: E42.14(C:O) E43.14(I3)
N$41: E42.13(D:O) E43.15(I2)
N$42: E36.13(D:O) E37.15(I2)
N$43: E36.14(C:O) E37.14(I3)
N$46: E36.2(B:O) E37.2(I1)
N$47: E3.5(C:I) E9.2(A:D) E9.8(B:!Q) E13.10(C:I1)
N$48: E3.1(A:I) E6.10(C:I1) E9.9(B:Q)
N$49: E3.3(B:I) E6.9(C:I0) E9.5(A:Q) E9.12(B:D)
N$50: E36.3(A:O) E37.3(I0)
N$51: E8.4(B:O) E12.13(B:CLR)
N$52: E38.10(E:O) E38.13(F:I)
N$53: E38.1(A:I) E38.8(D:O)
N$54: E38.6(C:O) E41.9(D:I)
N$55: E38.4(B:O) E41.5(C:I)
N$56: E37.5(Q0) E38.3(B:I)
N$57: E37.7(Q1) E38.5(C:I)
N$58: E37.9(Q2) E38.11(E:I)
N$59: E37.11(Q3) E38.9(D:I)
N$60: E43.5(Q0) E44.5(C:I)
N$61: E43.9(Q2) E44.13(F:I)
N$62: E43.11(Q3) E44.11(E:I)
N$63: E43.7(Q1) E44.9(D:I)
N$64: E41.3(B:I) E44.12(F:O)
N$65: E41.1(A:I) E44.10(E:O)
N$66: E41.11(E:I) E44.8(D:O)
N$67: E41.13(F:I) E44.6(C:O)
N$69: E3.9(D:I) E9.6(A:!Q) E13.9(C:I0)
N$70: E9.1(A:CLR) E9.4(A:PRE) E9.10(B:PRE) E9.13(B:CLR) R41.1
N$71: E1.9(C:I0) E1.10(C:I1) E3.10(E:O) E5.1(A:I0)
N$72: C62.1 E1.4(B:I1) R38.2
N$73: E8.8(D:O) R38.1
N$74: E1.5(B:I2) E1.8(C:O) E8.9(D:I)
N$75: C61.1 E1.11(C:I2) R35.2
N$76: C60.1 E5.2(A:I1) R34.2
N$78: E8.1(A:I) E12.6(A:!Q)
N$121: E1.12(A:O) E8.3(B:I)
N$130: E5.6(B:O) E8.5(C:I)
OUT_OF_TAPE: E5.9(C:I0) ; also sheet 1
PN_HOLE1: E41.12(F:O) J1.LL
PN_HOLE2: E41.10(E:O) J1.JJ
PN_HOLE3: E41.2(A:O) J1.FF
PN_HOLE4: E41.4(B:O) J1.DD
PN_HOLE5: E41.6(C:O) J1.Z
PN_HOLE6: E41.8(D:O) J1.X
PN_HOLE7: E38.2(A:O) J1.V
PN_HOLE8: E38.12(F:O) J1.T
PUNCH_DONE: E26.12(F:O) J1.N
PUNCH_FLAG: E18.12(D:I1) ; also sheet 1
RD_HOLE1: E40.14(I3) J2.L
RD_HOLE2: E40.15(I2) J2.N
RD_HOLE3: E40.2(I1) J2.R
RD_HOLE4: E40.3(I0) J2.T
RD_HOLE5: E34.14(I3) J2.V
RD_HOLE6: E34.15(I2) J2.X
RD_HOLE7: E34.2(I1) J2.Z
RD_HOLE8: E34.3(I0) J2.BB
RDATA_STROBE: E12.11(B:CLK) E26.5(C:I) ; also sheet 1
RDATA_TO_BUS: E33.3(A:I1) E33.6(B:I1) E33.8(C:I0) E33.11(D:I0) E39.3(A:I1) E39.5(B:I0) E39.9(C:I1) E39.11(D:I0) ; also sheet 1
RDR_RUN: E12.12(B:D) ; also sheet 1
RIOP1: E18.6(B:I1) ; also sheet 1
ROTATE_PULSE: E6.6(B:O) E9.3(A:CLK) E9.11(B:CLK)
SCR_ACTIVE: J1.F R46.2
VCC [supply]: R41.2 R42.2 R43.2 ; also sheet 1
Unconnected: E12.5(A:Q) E12.8(B:!Q) E34.12(Q4) E37.12(Q4) E40.12(Q4) E43.12(Q4)

### Notes on the sheet
- READER BUFFER | PUNCH BUFFER
- MOTOR
- POWER
- 750ns
- 150ns
- B
- A
- READER
- DONE
- M840 Reader/Punch Control
- E-CS-M840-0-1

## Power pins joined to a net without a drawn wire
GND: E1.7(P:GND) E2.7(P:GND) E3.7(P:GND) E4.7(GND) E5.7(P:GND) E6.7(P:GND) E7.7(GND) E8.7(P:GND) E9.7(P:GND) E10.7(P:GND) E11.7(P:GND) E12.7(P:GND) E13.7(P:GND) E14.7(P:GND) E15.7(GND) E16.1(GND) E17.7(P:GND) E18.7(P:GND) E19.7(GND) E20.1(P:GND) E21.1(GND) E22.7(P:GND) E23.7(P:GND) E24.1(P:GND) E25.1(GND) E26.7(P:GND) E27.8(GND) E28.7(P:GND) E29.7(P:GND) E30.1(P:GND) E31.8(GND) E32.7(P:GND) E33.7(P:GND) E34.8(GND) E35.7(P:GND) E36.1(P:GND) E37.8(GND) E38.7(P:GND) E39.7(P:GND) E40.8(GND) E41.7(P:GND) E42.1(P:GND) E43.8(GND) E44.7(P:GND)
VCC: E1.14(P:VCC) E2.14(P:VCC) E3.14(P:VCC) E4.14(VCC) E5.14(P:VCC) E6.14(P:VCC) E7.14(VCC) E8.14(P:VCC) E9.14(P:VCC) E10.14(P:VCC) E11.14(P:VCC) E12.14(P:VCC) E13.14(P:VCC) E14.14(P:VCC) E15.14(VCC) E16.8(VCC) E17.14(P:VCC) E18.14(P:VCC) E19.14(VCC) E20.8(P:VCC) E21.8(VCC) E22.14(P:VCC) E23.14(P:VCC) E24.8(P:VCC) E25.8(VCC) E26.14(P:VCC) E27.16(VCC) E28.14(P:VCC) E29.14(P:VCC) E30.8(P:VCC) E31.16(VCC) E32.14(P:VCC) E33.14(P:VCC) E34.16(VCC) E35.14(P:VCC) E36.8(P:VCC) E37.16(VCC) E38.14(P:VCC) E39.14(P:VCC) E40.16(VCC) E41.14(P:VCC) E42.8(P:VCC) E43.16(VCC) E44.14(P:VCC)

## Library data of the parts
C1-C30 C32-C44 C50 C51 C55 C60-C64 = dec-con:C-US: Capacitors with funky DEC lead spacing.
C31 C48 C53 C54 C56 C58 C59 = dec-con:CPOL-USE15-5AXIAL: 0.6" version of an electrolytic
C45-C47 C52 C57 C65 C66 = dec-con:CPOL-USE20-8AXIAL: A 0.8 inch electrolytic.
D1-D7 = diode:DIODE-: DIODE
E1 E11 = 74xx-us:74*10: Triple 3-input NAND gate
E2 E9 E10 E12 E14 = 74xx-us:74*74: Dual D type positive edge triggered FLIP FLOP, preset and clear
E3 E8 E26 E29 E38 E41 E44 = 74xx-us:74*04: Hex INVERTER
E4 E7 E15 E19 = dec-con:9601: DEC9601 monstable
E5 E6 E13 E22 E23 E28 E32 = 74xx-us:74*00: Quad 2-input NAND gate
E16 = dec-con:SP384: Quad OR gate
E17 E18 E33 E39 = dec-con:N8881: Quad 2-input NAND gate, open collector
E20 E24 E30 E36 E42 = dec-con:SP380: Quad NOR gate (use 8640)
E21 E25 = dec-con:SP314: 7-Input NOR gate
E27 E31 = dec-con:DEC8251: BCD Decoder
E34 E37 E40 E43 = dec-con:DEC8271: Parallel Load Shift Register
E35 = dec-con:74*20: Dual 4-input NAND gate
J1 J2 = dec-con:DEC40PINS: 40 pin ribbon connector for BC08, BC11 cables.
OMNIBUS = dec-con:QUAD: Quad-Height DEC board
Q1-Q6 Q9 Q10 = transistor:*-PNP-: PNP Transistror
Q7 Q8 = transistor:*-NPN-: NPN Transistror BF959 corrected 2008.03.06
R1-R26 R28-R38 R40-R52 = rcl:R-US_: RESISTOR, American symbol
R27 = dec-con:275P: Trimpot with 275P (3006Y) footprint.
U$1 = dec-con:OUTLINE-*: Board outlines for DEC boards.
W1 W2 = rcl:R-EU_: RESISTOR, European symbol

## Net classes
1 supply: width 0.813 mm